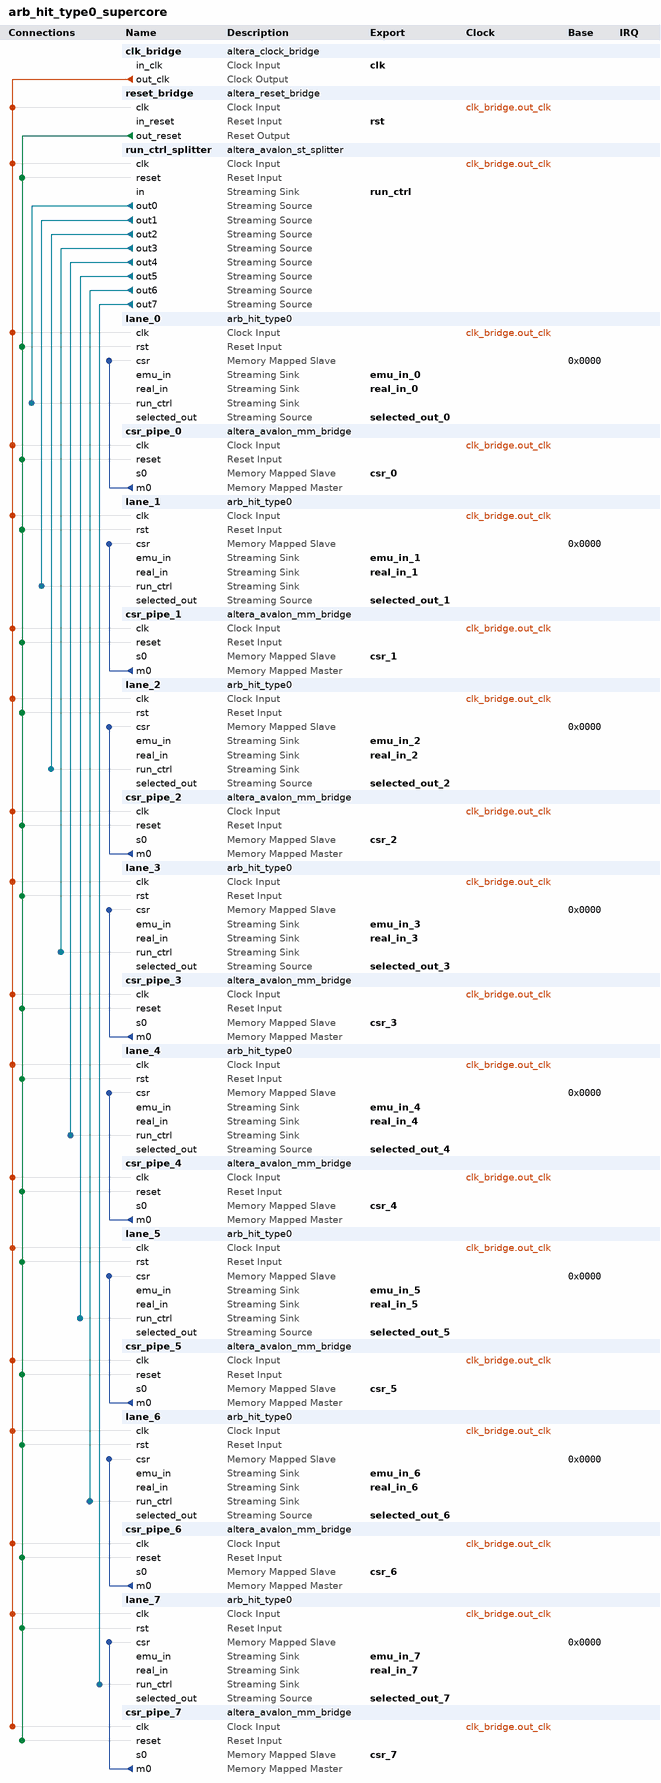
[diagram p0: system contents]
# Platform Designer (Qsys) system arb_hit_type0_supercore, Arria V 5AGXBA7D4F31C5
# Parameters at their usual value, and those the tool derives, are not listed.
package require -exact qsys 18.1
create_system arb_hit_type0_supercore
set_project_property DEVICE_FAMILY {Arria V}
set_project_property DEVICE 5AGXBA7D4F31C5

add_instance clk_bridge altera_clock_bridge 18.1
set_instance_parameter_value clk_bridge DERIVED_CLOCK_RATE 0
set_instance_parameter_value clk_bridge EXPLICIT_CLOCK_RATE 0

add_instance reset_bridge altera_reset_bridge 18.1
set_instance_parameter_value reset_bridge ACTIVE_LOW_RESET 0
set_instance_parameter_value reset_bridge SYNCHRONOUS_EDGES deassert

add_instance run_ctrl_splitter altera_avalon_st_splitter 18.1
set_instance_parameter_value run_ctrl_splitter BITS_PER_SYMBOL 9
set_instance_parameter_value run_ctrl_splitter CHANNEL_WIDTH 1
set_instance_parameter_value run_ctrl_splitter DATA_WIDTH 9
set_instance_parameter_value run_ctrl_splitter ERROR_WIDTH 1
set_instance_parameter_value run_ctrl_splitter MAX_CHANNELS 1
set_instance_parameter_value run_ctrl_splitter NUMBER_OF_OUTPUTS 8
set_instance_parameter_value run_ctrl_splitter QUALIFY_VALID_OUT 0
set_instance_parameter_value run_ctrl_splitter READY_LATENCY 0
set_instance_parameter_value run_ctrl_splitter USE_CHANNEL 0
set_instance_parameter_value run_ctrl_splitter USE_DATA 1
set_instance_parameter_value run_ctrl_splitter USE_ERROR 0
set_instance_parameter_value run_ctrl_splitter USE_PACKETS 0
set_instance_parameter_value run_ctrl_splitter USE_READY 0
set_instance_parameter_value run_ctrl_splitter USE_VALID 1

add_instance lane_0 arb_hit_type0 26.5.0.511
set_instance_parameter_value lane_0 BUILD 511
set_instance_parameter_value lane_0 DEBUG_LEVEL 0
set_instance_parameter_value lane_0 FIFO_DEPTH 16
set_instance_parameter_value lane_0 INSTANCE_ID 0
set_instance_parameter_value lane_0 IP_UID 1095263280
set_instance_parameter_value lane_0 MODE_DEFAULT 1
set_instance_parameter_value lane_0 VERSION_DATE 20260511
set_instance_parameter_value lane_0 VERSION_GIT 0
set_instance_parameter_value lane_0 VERSION_MAJOR 26
set_instance_parameter_value lane_0 VERSION_MINOR 5
set_instance_parameter_value lane_0 VERSION_PATCH 0
set_instance_parameter_value lane_0 WATCHDOG_DEFAULT 500

add_instance csr_pipe_0 altera_avalon_mm_bridge 18.1
set_instance_parameter_value csr_pipe_0 ADDRESS_UNITS WORDS
set_instance_parameter_value csr_pipe_0 ADDRESS_WIDTH 5
set_instance_parameter_value csr_pipe_0 DATA_WIDTH 32
set_instance_parameter_value csr_pipe_0 MAX_PENDING_RESPONSES 1
set_instance_parameter_value csr_pipe_0 USE_AUTO_ADDRESS_WIDTH 0

add_instance lane_1 arb_hit_type0 26.5.0.511
set_instance_parameter_value lane_1 BUILD 511
set_instance_parameter_value lane_1 DEBUG_LEVEL 0
set_instance_parameter_value lane_1 FIFO_DEPTH 16
set_instance_parameter_value lane_1 INSTANCE_ID 1
set_instance_parameter_value lane_1 IP_UID 1095263280
set_instance_parameter_value lane_1 MODE_DEFAULT 1
set_instance_parameter_value lane_1 VERSION_DATE 20260511
set_instance_parameter_value lane_1 VERSION_GIT 0
set_instance_parameter_value lane_1 VERSION_MAJOR 26
set_instance_parameter_value lane_1 VERSION_MINOR 5
set_instance_parameter_value lane_1 VERSION_PATCH 0
set_instance_parameter_value lane_1 WATCHDOG_DEFAULT 500

add_instance csr_pipe_1 altera_avalon_mm_bridge 18.1
set_instance_parameter_value csr_pipe_1 ADDRESS_UNITS WORDS
set_instance_parameter_value csr_pipe_1 ADDRESS_WIDTH 5
set_instance_parameter_value csr_pipe_1 DATA_WIDTH 32
set_instance_parameter_value csr_pipe_1 MAX_PENDING_RESPONSES 1
set_instance_parameter_value csr_pipe_1 USE_AUTO_ADDRESS_WIDTH 0

add_instance lane_2 arb_hit_type0 26.5.0.511
set_instance_parameter_value lane_2 BUILD 511
set_instance_parameter_value lane_2 DEBUG_LEVEL 0
set_instance_parameter_value lane_2 FIFO_DEPTH 16
set_instance_parameter_value lane_2 INSTANCE_ID 2
set_instance_parameter_value lane_2 IP_UID 1095263280
set_instance_parameter_value lane_2 MODE_DEFAULT 1
set_instance_parameter_value lane_2 VERSION_DATE 20260511
set_instance_parameter_value lane_2 VERSION_GIT 0
set_instance_parameter_value lane_2 VERSION_MAJOR 26
set_instance_parameter_value lane_2 VERSION_MINOR 5
set_instance_parameter_value lane_2 VERSION_PATCH 0
set_instance_parameter_value lane_2 WATCHDOG_DEFAULT 500

add_instance csr_pipe_2 altera_avalon_mm_bridge 18.1
set_instance_parameter_value csr_pipe_2 ADDRESS_UNITS WORDS
set_instance_parameter_value csr_pipe_2 ADDRESS_WIDTH 5
set_instance_parameter_value csr_pipe_2 DATA_WIDTH 32
set_instance_parameter_value csr_pipe_2 MAX_PENDING_RESPONSES 1
set_instance_parameter_value csr_pipe_2 USE_AUTO_ADDRESS_WIDTH 0

add_instance lane_3 arb_hit_type0 26.5.0.511
set_instance_parameter_value lane_3 BUILD 511
set_instance_parameter_value lane_3 DEBUG_LEVEL 0
set_instance_parameter_value lane_3 FIFO_DEPTH 16
set_instance_parameter_value lane_3 INSTANCE_ID 3
set_instance_parameter_value lane_3 IP_UID 1095263280
set_instance_parameter_value lane_3 MODE_DEFAULT 1
set_instance_parameter_value lane_3 VERSION_DATE 20260511
set_instance_parameter_value lane_3 VERSION_GIT 0
set_instance_parameter_value lane_3 VERSION_MAJOR 26
set_instance_parameter_value lane_3 VERSION_MINOR 5
set_instance_parameter_value lane_3 VERSION_PATCH 0
set_instance_parameter_value lane_3 WATCHDOG_DEFAULT 500

add_instance csr_pipe_3 altera_avalon_mm_bridge 18.1
set_instance_parameter_value csr_pipe_3 ADDRESS_UNITS WORDS
set_instance_parameter_value csr_pipe_3 ADDRESS_WIDTH 5
set_instance_parameter_value csr_pipe_3 DATA_WIDTH 32
set_instance_parameter_value csr_pipe_3 MAX_PENDING_RESPONSES 1
set_instance_parameter_value csr_pipe_3 USE_AUTO_ADDRESS_WIDTH 0

add_instance lane_4 arb_hit_type0 26.5.0.511
set_instance_parameter_value lane_4 BUILD 511
set_instance_parameter_value lane_4 DEBUG_LEVEL 0
set_instance_parameter_value lane_4 FIFO_DEPTH 16
set_instance_parameter_value lane_4 INSTANCE_ID 4
set_instance_parameter_value lane_4 IP_UID 1095263280
set_instance_parameter_value lane_4 MODE_DEFAULT 1
set_instance_parameter_value lane_4 VERSION_DATE 20260511
set_instance_parameter_value lane_4 VERSION_GIT 0
set_instance_parameter_value lane_4 VERSION_MAJOR 26
set_instance_parameter_value lane_4 VERSION_MINOR 5
set_instance_parameter_value lane_4 VERSION_PATCH 0
set_instance_parameter_value lane_4 WATCHDOG_DEFAULT 500

add_instance csr_pipe_4 altera_avalon_mm_bridge 18.1
set_instance_parameter_value csr_pipe_4 ADDRESS_UNITS WORDS
set_instance_parameter_value csr_pipe_4 ADDRESS_WIDTH 5
set_instance_parameter_value csr_pipe_4 DATA_WIDTH 32
set_instance_parameter_value csr_pipe_4 MAX_PENDING_RESPONSES 1
set_instance_parameter_value csr_pipe_4 USE_AUTO_ADDRESS_WIDTH 0

add_instance lane_5 arb_hit_type0 26.5.0.511
set_instance_parameter_value lane_5 BUILD 511
set_instance_parameter_value lane_5 DEBUG_LEVEL 0
set_instance_parameter_value lane_5 FIFO_DEPTH 16
set_instance_parameter_value lane_5 INSTANCE_ID 5
set_instance_parameter_value lane_5 IP_UID 1095263280
set_instance_parameter_value lane_5 MODE_DEFAULT 1
set_instance_parameter_value lane_5 VERSION_DATE 20260511
set_instance_parameter_value lane_5 VERSION_GIT 0
set_instance_parameter_value lane_5 VERSION_MAJOR 26
set_instance_parameter_value lane_5 VERSION_MINOR 5
set_instance_parameter_value lane_5 VERSION_PATCH 0
set_instance_parameter_value lane_5 WATCHDOG_DEFAULT 500

add_instance csr_pipe_5 altera_avalon_mm_bridge 18.1
set_instance_parameter_value csr_pipe_5 ADDRESS_UNITS WORDS
set_instance_parameter_value csr_pipe_5 ADDRESS_WIDTH 5
set_instance_parameter_value csr_pipe_5 DATA_WIDTH 32
set_instance_parameter_value csr_pipe_5 MAX_PENDING_RESPONSES 1
set_instance_parameter_value csr_pipe_5 USE_AUTO_ADDRESS_WIDTH 0

add_instance lane_6 arb_hit_type0 26.5.0.511
set_instance_parameter_value lane_6 BUILD 511
set_instance_parameter_value lane_6 DEBUG_LEVEL 0
set_instance_parameter_value lane_6 FIFO_DEPTH 16
set_instance_parameter_value lane_6 INSTANCE_ID 6
set_instance_parameter_value lane_6 IP_UID 1095263280
set_instance_parameter_value lane_6 MODE_DEFAULT 1
set_instance_parameter_value lane_6 VERSION_DATE 20260511
set_instance_parameter_value lane_6 VERSION_GIT 0
set_instance_parameter_value lane_6 VERSION_MAJOR 26
set_instance_parameter_value lane_6 VERSION_MINOR 5
set_instance_parameter_value lane_6 VERSION_PATCH 0
set_instance_parameter_value lane_6 WATCHDOG_DEFAULT 500

add_instance csr_pipe_6 altera_avalon_mm_bridge 18.1
set_instance_parameter_value csr_pipe_6 ADDRESS_UNITS WORDS
set_instance_parameter_value csr_pipe_6 ADDRESS_WIDTH 5
set_instance_parameter_value csr_pipe_6 DATA_WIDTH 32
set_instance_parameter_value csr_pipe_6 MAX_PENDING_RESPONSES 1
set_instance_parameter_value csr_pipe_6 USE_AUTO_ADDRESS_WIDTH 0

add_instance lane_7 arb_hit_type0 26.5.0.511
set_instance_parameter_value lane_7 BUILD 511
set_instance_parameter_value lane_7 DEBUG_LEVEL 0
set_instance_parameter_value lane_7 FIFO_DEPTH 16
set_instance_parameter_value lane_7 INSTANCE_ID 7
set_instance_parameter_value lane_7 IP_UID 1095263280
set_instance_parameter_value lane_7 MODE_DEFAULT 1
set_instance_parameter_value lane_7 VERSION_DATE 20260511
set_instance_parameter_value lane_7 VERSION_GIT 0
set_instance_parameter_value lane_7 VERSION_MAJOR 26
set_instance_parameter_value lane_7 VERSION_MINOR 5
set_instance_parameter_value lane_7 VERSION_PATCH 0
set_instance_parameter_value lane_7 WATCHDOG_DEFAULT 500

add_instance csr_pipe_7 altera_avalon_mm_bridge 18.1
set_instance_parameter_value csr_pipe_7 ADDRESS_UNITS WORDS
set_instance_parameter_value csr_pipe_7 ADDRESS_WIDTH 5
set_instance_parameter_value csr_pipe_7 DATA_WIDTH 32
set_instance_parameter_value csr_pipe_7 MAX_PENDING_RESPONSES 1
set_instance_parameter_value csr_pipe_7 USE_AUTO_ADDRESS_WIDTH 0

# connections
add_connection clk_bridge.out_clk csr_pipe_0.clk clock
add_connection clk_bridge.out_clk csr_pipe_1.clk clock
add_connection clk_bridge.out_clk csr_pipe_2.clk clock
add_connection clk_bridge.out_clk csr_pipe_3.clk clock
add_connection clk_bridge.out_clk csr_pipe_4.clk clock
add_connection clk_bridge.out_clk csr_pipe_5.clk clock
add_connection clk_bridge.out_clk csr_pipe_6.clk clock
add_connection clk_bridge.out_clk csr_pipe_7.clk clock
add_connection clk_bridge.out_clk lane_0.clk clock
add_connection clk_bridge.out_clk lane_1.clk clock
add_connection clk_bridge.out_clk lane_2.clk clock
add_connection clk_bridge.out_clk lane_3.clk clock
add_connection clk_bridge.out_clk lane_4.clk clock
add_connection clk_bridge.out_clk lane_5.clk clock
add_connection clk_bridge.out_clk lane_6.clk clock
add_connection clk_bridge.out_clk lane_7.clk clock
add_connection clk_bridge.out_clk reset_bridge.clk clock
add_connection clk_bridge.out_clk run_ctrl_splitter.clk clock
add_connection reset_bridge.out_reset csr_pipe_0.reset reset
add_connection reset_bridge.out_reset csr_pipe_1.reset reset
add_connection reset_bridge.out_reset csr_pipe_2.reset reset
add_connection reset_bridge.out_reset csr_pipe_3.reset reset
add_connection reset_bridge.out_reset csr_pipe_4.reset reset
add_connection reset_bridge.out_reset csr_pipe_5.reset reset
add_connection reset_bridge.out_reset csr_pipe_6.reset reset
add_connection reset_bridge.out_reset csr_pipe_7.reset reset
add_connection reset_bridge.out_reset lane_0.rst reset
add_connection reset_bridge.out_reset lane_1.rst reset
add_connection reset_bridge.out_reset lane_2.rst reset
add_connection reset_bridge.out_reset lane_3.rst reset
add_connection reset_bridge.out_reset lane_4.rst reset
add_connection reset_bridge.out_reset lane_5.rst reset
add_connection reset_bridge.out_reset lane_6.rst reset
add_connection reset_bridge.out_reset lane_7.rst reset
add_connection reset_bridge.out_reset run_ctrl_splitter.reset reset
add_connection csr_pipe_0.m0 lane_0.csr avalon
set_connection_parameter_value csr_pipe_0.m0/lane_0.csr baseAddress 0x0000
add_connection csr_pipe_1.m0 lane_1.csr avalon
set_connection_parameter_value csr_pipe_1.m0/lane_1.csr baseAddress 0x0000
add_connection csr_pipe_2.m0 lane_2.csr avalon
set_connection_parameter_value csr_pipe_2.m0/lane_2.csr baseAddress 0x0000
add_connection csr_pipe_3.m0 lane_3.csr avalon
set_connection_parameter_value csr_pipe_3.m0/lane_3.csr baseAddress 0x0000
add_connection csr_pipe_4.m0 lane_4.csr avalon
set_connection_parameter_value csr_pipe_4.m0/lane_4.csr baseAddress 0x0000
add_connection csr_pipe_5.m0 lane_5.csr avalon
set_connection_parameter_value csr_pipe_5.m0/lane_5.csr baseAddress 0x0000
add_connection csr_pipe_6.m0 lane_6.csr avalon
set_connection_parameter_value csr_pipe_6.m0/lane_6.csr baseAddress 0x0000
add_connection csr_pipe_7.m0 lane_7.csr avalon
set_connection_parameter_value csr_pipe_7.m0/lane_7.csr baseAddress 0x0000
add_connection run_ctrl_splitter.out0 lane_0.run_ctrl avalon_streaming
add_connection run_ctrl_splitter.out1 lane_1.run_ctrl avalon_streaming
add_connection run_ctrl_splitter.out2 lane_2.run_ctrl avalon_streaming
add_connection run_ctrl_splitter.out3 lane_3.run_ctrl avalon_streaming
add_connection run_ctrl_splitter.out4 lane_4.run_ctrl avalon_streaming
add_connection run_ctrl_splitter.out5 lane_5.run_ctrl avalon_streaming
add_connection run_ctrl_splitter.out6 lane_6.run_ctrl avalon_streaming
add_connection run_ctrl_splitter.out7 lane_7.run_ctrl avalon_streaming

# exported interfaces
add_interface clk clock sink
set_interface_property clk EXPORT_OF clk_bridge.in_clk
add_interface csr_0 avalon slave
set_interface_property csr_0 EXPORT_OF csr_pipe_0.s0
add_interface csr_1 avalon slave
set_interface_property csr_1 EXPORT_OF csr_pipe_1.s0
add_interface csr_2 avalon slave
set_interface_property csr_2 EXPORT_OF csr_pipe_2.s0
add_interface csr_3 avalon slave
set_interface_property csr_3 EXPORT_OF csr_pipe_3.s0
add_interface csr_4 avalon slave
set_interface_property csr_4 EXPORT_OF csr_pipe_4.s0
add_interface csr_5 avalon slave
set_interface_property csr_5 EXPORT_OF csr_pipe_5.s0
add_interface csr_6 avalon slave
set_interface_property csr_6 EXPORT_OF csr_pipe_6.s0
add_interface csr_7 avalon slave
set_interface_property csr_7 EXPORT_OF csr_pipe_7.s0
add_interface emu_in_0 avalon_streaming sink
set_interface_property emu_in_0 EXPORT_OF lane_0.emu_in
add_interface emu_in_1 avalon_streaming sink
set_interface_property emu_in_1 EXPORT_OF lane_1.emu_in
add_interface emu_in_2 avalon_streaming sink
set_interface_property emu_in_2 EXPORT_OF lane_2.emu_in
add_interface emu_in_3 avalon_streaming sink
set_interface_property emu_in_3 EXPORT_OF lane_3.emu_in
add_interface emu_in_4 avalon_streaming sink
set_interface_property emu_in_4 EXPORT_OF lane_4.emu_in
add_interface emu_in_5 avalon_streaming sink
set_interface_property emu_in_5 EXPORT_OF lane_5.emu_in
add_interface emu_in_6 avalon_streaming sink
set_interface_property emu_in_6 EXPORT_OF lane_6.emu_in
add_interface emu_in_7 avalon_streaming sink
set_interface_property emu_in_7 EXPORT_OF lane_7.emu_in
add_interface real_in_0 avalon_streaming sink
set_interface_property real_in_0 EXPORT_OF lane_0.real_in
add_interface real_in_1 avalon_streaming sink
set_interface_property real_in_1 EXPORT_OF lane_1.real_in
add_interface real_in_2 avalon_streaming sink
set_interface_property real_in_2 EXPORT_OF lane_2.real_in
add_interface real_in_3 avalon_streaming sink
set_interface_property real_in_3 EXPORT_OF lane_3.real_in
add_interface real_in_4 avalon_streaming sink
set_interface_property real_in_4 EXPORT_OF lane_4.real_in
add_interface real_in_5 avalon_streaming sink
set_interface_property real_in_5 EXPORT_OF lane_5.real_in
add_interface real_in_6 avalon_streaming sink
set_interface_property real_in_6 EXPORT_OF lane_6.real_in
add_interface real_in_7 avalon_streaming sink
set_interface_property real_in_7 EXPORT_OF lane_7.real_in
add_interface rst reset sink
set_interface_property rst EXPORT_OF reset_bridge.in_reset
add_interface run_ctrl avalon_streaming sink
set_interface_property run_ctrl EXPORT_OF run_ctrl_splitter.in
add_interface selected_out_0 avalon_streaming source
set_interface_property selected_out_0 EXPORT_OF lane_0.selected_out
add_interface selected_out_1 avalon_streaming source
set_interface_property selected_out_1 EXPORT_OF lane_1.selected_out
add_interface selected_out_2 avalon_streaming source
set_interface_property selected_out_2 EXPORT_OF lane_2.selected_out
add_interface selected_out_3 avalon_streaming source
set_interface_property selected_out_3 EXPORT_OF lane_3.selected_out
add_interface selected_out_4 avalon_streaming source
set_interface_property selected_out_4 EXPORT_OF lane_4.selected_out
add_interface selected_out_5 avalon_streaming source
set_interface_property selected_out_5 EXPORT_OF lane_5.selected_out
add_interface selected_out_6 avalon_streaming source
set_interface_property selected_out_6 EXPORT_OF lane_6.selected_out
add_interface selected_out_7 avalon_streaming source
set_interface_property selected_out_7 EXPORT_OF lane_7.selected_out

set_interconnect_requirement {$system} qsys_mm.clockCrossingAdapter AUTO
set_interconnect_requirement {$system} qsys_mm.enableEccProtection FALSE
set_interconnect_requirement {$system} qsys_mm.enableInstrumentation FALSE
set_interconnect_requirement {$system} qsys_mm.insertDefaultSlave FALSE
set_interconnect_requirement {$system} qsys_mm.maxAdditionalLatency 4

save_system arb_hit_type0_supercore.qsys
